# EAGLE design MySens-GWeasyRS485-Nano-V02-003 (EAGLE 7.3.0)
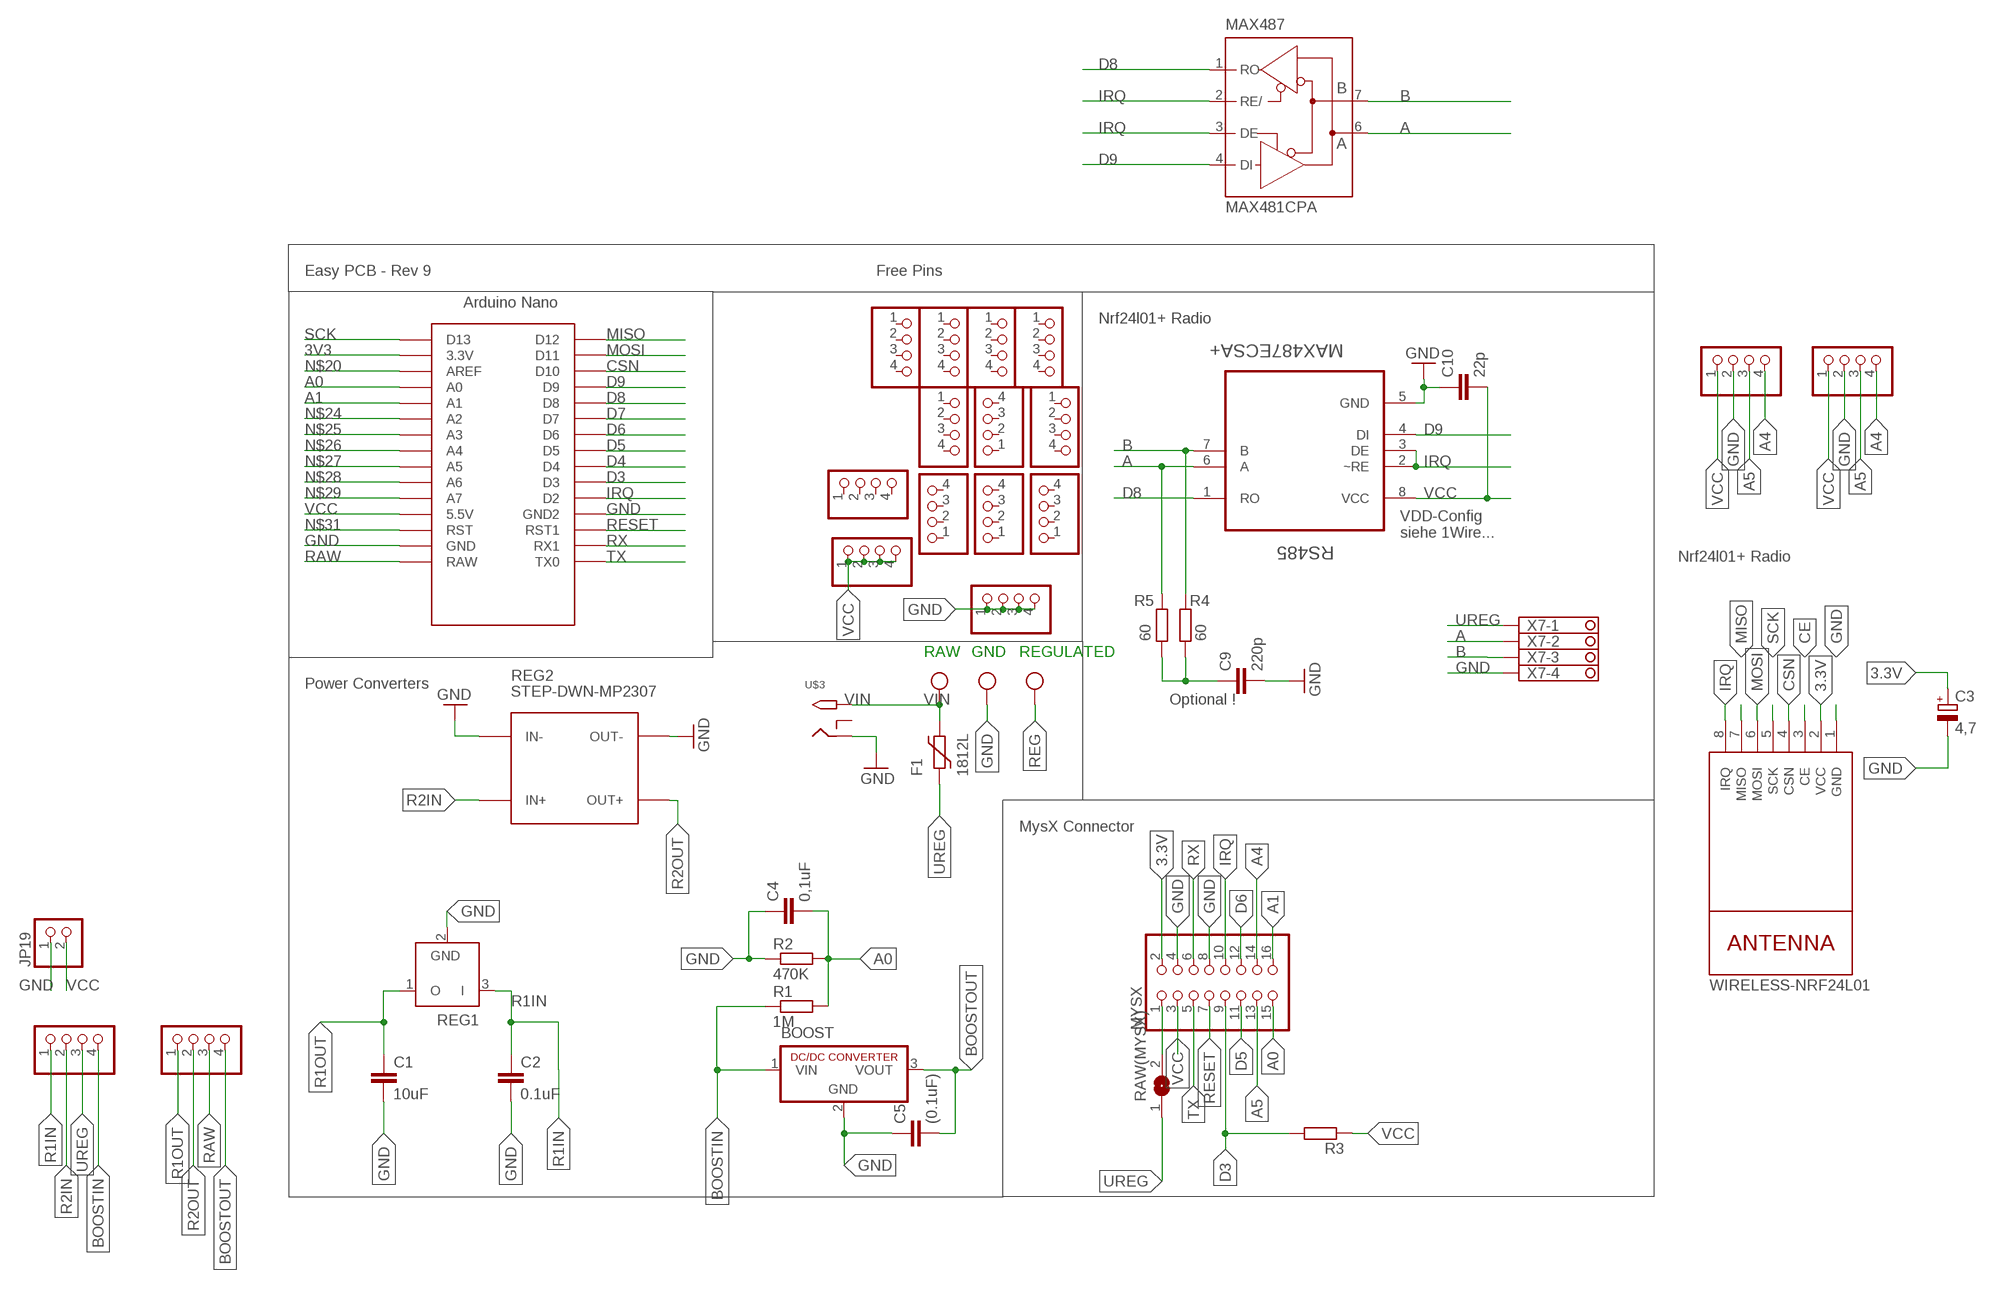
[diagram p0: schematic, sheet 1]

## Parts
BOOST  R-78C1.8-1.0  [SIP3]
C1  10uF  C-EUC1210  [C1210]
C2  0.1uF  C-EUC1206  [C1206]
C3  4,7  CPOL-EUSMCC  [SMC_C]
C4  0,1uF  C-EUC1206  [C1206]
C5  (0.1uF)  C-EUC1206  [C1206]
C9  220p  C-EUC0805  [C0805]
C10  22p  C-EUC0805  [C0805]
F1  1812L  [1812L]
JP1  PINHD-1X04_2.54-S  [1X04-S]
JP2  PINHD-1X04_2.54-S  [1X04-S]
JP3  PINHD-1X04_2.54-S  [1X04-S]
JP4  PINHD-1X04_2.54-S  [1X04-S]
JP5  PINHD-1X04_2.54-S  [1X04-S]
JP6  PINHD-1X04_2.54-S  [1X04-S]
JP7  PINHD-1X04_2.54-S  [1X04-S]
JP9  PINHD-1X04_2.54-S  [1X04-S]
JP10  PINHD-1X04_2.54-S  [1X04-S]
JP11  PINHD-1X04_2.54-S  [1X04-S]
JP12  PINHD-1X04_2.54-S  [1X04-S]
JP13  PINHD-1X04_2.54-S  [1X04-S]
JP14  PINHD-1X04_2.54-S  [1X04-S]
JP15  PINHD-1X04_2.54-S  [1X04-S]
JP16  PINHD-1X04_2.54-S  [1X04-S]
JP17  PINHD-1X04_2.54-S  [1X04-S]
JP18  PINHD-1X04_2.54-S  [1X04-S]
JP19  PINHD-1X2  [1X02]
MAX487  MAX481CPA  [DIL08]
MYSX  PINHD-2X08_2.54  [2X08]
NRF24L01+  WIRELESS-NRF24L01  [WIRELESS-NRF24L01]
R1  1M  R-EU_R0805  [R0805]
R2  470K  R-EU_R0805  [R0805]
R3  R-EU_R0805  [R0805]
R4  60  R-EU_R0805  [R0805]
R5  60  R-EU_R0805  [R0805]
RAW(MYSX)  SJ  [SJ]
REG1  LP2950Z  [TO92]
REG2  STEP-DWN-MP2307  DC-DC-STEP-DOWN-MP2307  [DC-DC-STEP-DOWN-MP2307]
REGULATED  W237-103  [W237-103]
RS485  MAX487ECSA+  [SOIC127P600X175-8N]
U$2  NANO  [NANO]
U$3  2.1MMJACKTHM  [PJ-102A]
X7  1751264  [1751264]

## Nets
3.3V [Power]: C3.+ MYSX.2 NRF24L01+.2(VCC)
3V3: U$2.3.3V
A: MAX487.6(A) R5.2 RS485.6(A) X7.2
A0: C4.2 MYSX.15 R1.2 R2.2 U$2.A0
A1: MYSX.16 U$2.A1
A4: JP6.4 JP10.4 MYSX.14
A5: JP6.3 JP10.3 MYSX.13
B: MAX487.7(B) R4.2 RS485.7(B) X7.3
BOOSTIN [Power]: BOOST.1(VIN) JP2.4 R1.1
BOOSTOUT [Power]: BOOST.3(VOUT) C5.2 JP4.4
CE: NRF24L01+.3(CE)
CSN: NRF24L01+.4(CSN) U$2.D10
D3: MYSX.9 R3.2 U$2.D3
D4: U$2.D4
D5: MYSX.11 U$2.D5
D6: MYSX.12 U$2.D6
D7: U$2.D7
D8: MAX487.1(RO) RS485.1(RO) U$2.D8
D9: MAX487.4(DI) RS485.4(DI) U$2.D9
GND [Power]: BOOST.2(GND) C1.2 C2.2 C3.- C4.1 C5.1 C9.2 C10.1 JP1.1 JP1.2 JP1.3 JP1.4 JP6.2 JP10.2 JP19.1 MYSX.4 MYSX.8 NRF24L01+.1(GND) R2.1 REG1.2(GND) REG2.IN- REG2.OUT- REGULATED.2 RS485.5(GND) U$2.GND U$2.GND1(GND2) U$3.RING X7.4
IRQ: MAX487.2(RE/) MAX487.3(DE) MYSX.10 NRF24L01+.8(IRQ) RS485.2(~RE) RS485.3(DE) U$2.D2
MISO: NRF24L01+.7(MISO) U$2.D12
MOSI: NRF24L01+.6(MOSI) U$2.D11
N$1: MYSX.1 RAW(MYSX).2
N$20: U$2.AREF
N$21: C9.1 R4.1 R5.1
N$24: U$2.A2
N$25: U$2.A3
N$26: U$2.A4
N$27: U$2.A5
N$28: U$2.A6
N$29: U$2.A7
N$31: U$2.RST
R1IN [Power]: C2.1 JP2.1 REG1.3(I)
R1OUT [Power]: C1.1 JP4.1 REG1.1(O)
R2IN [Power]: JP2.2 REG2.IN+
R2OUT [Power]: JP4.2 REG2.OUT+
RAW [Power]: JP4.3 U$2.RAW
REG [Power]: REGULATED.1
RESET: MYSX.7 U$2.RST1
RX: MYSX.6 U$2.RX1
SCK: NRF24L01+.5(SCK) U$2.D13
TX: MYSX.5 U$2.TX0
UREG [Power]: F1.P$1 JP2.3 RAW(MYSX).1 X7.1
VCC [Power]: C10.2 JP3.1 JP3.2 JP3.3 JP3.4 JP6.1 JP10.1 JP19.2 MYSX.3 R3.1 RS485.8(VCC) U$2.5V(5.5V)
VIN [Power]: F1.P$2 REGULATED.3 U$3.TIP
Unconnected: JP5.1 JP5.2 JP5.3 JP5.4 JP7.1 JP7.2 JP7.3 JP7.4 JP9.1 JP9.2 JP9.3 JP9.4 JP11.1 JP11.2 JP11.3 JP11.4 JP12.1 JP12.2 JP12.3 JP12.4 JP13.1 JP13.2 JP13.3 JP13.4 JP14.1 JP14.2 JP14.3 JP14.4 JP15.1 JP15.2 JP15.3 JP15.4 JP16.1 JP16.2 JP16.3 JP16.4 JP17.1 JP17.2 JP17.3 JP17.4 JP18.1 JP18.2 JP18.3 JP18.4 U$2.ICSP1 U$2.ICSP2 U$2.ICSP3 U$2.ICSP4 U$2.ICSP5 U$2.ICSP6 U$3.RING_SW

## Notes on the sheet
- Easy PCB - Rev 9 | Free Pins
- Nrf24l01+ Radio
- VDD-Config
  siehe 1Wire...
- Nrf24l01+ Radio
- RAW | GND | REGULATED
- Power Converters
- Optional !
- MysX Connector

## Power pins joined to a net without a drawn wire
GND: MAX487.5(GND)
VCC: MAX487.8(VCC)

## Library data of the parts
BOOST = dc-dc-converter:R-78C*-1.0: INNOLINE DC/DC-Converter 1.0 AMP SIP3 Single Output Source: Data sheet <http://www.mikrocontroller.net/attachment/150645/157764-da-01-en-DC_DC_WANDLER_R_78C5_0_1_0.pdf>
C1 C2 C4 C5 C9 C10 = rcl:C-EU: CAPACITOR, European symbol
C3 = rcl:CPOL-EU: POLARIZED CAPACITOR, European symbol
F1 = ptc-littlefuse:1812L
JP1-JP7 JP9-JP18 = pinhead-2:PINHD-1X04: PIN HEADER
JP19 = pinhead:PINHD-1X2: PIN HEADER
MAX487 = maxim-4:MAX481CPA: RS485 TRANSEIVER
MYSX = pinhead-2:PINHD-2X08: PIN HEADER
NRF24L01+ = diy-modules:WIRELESS-NRF24L01: 2.4 GHz Wireless Module based on NRF24L01 chip
R1-R5 = rcl:R-EU_: RESISTOR, European symbol
RAW(MYSX) = jumper:SJ: SMD solder JUMPER
REG1 = linear:LP2950: 100 mA, Low Power Low Dropout Voltage Regulator Source: http://www.onsemi.com/pub/Collateral/LP2950-D.PDF
REG2 = diy-modules:DC-DC-STEP-DOWN-MP2307: DC/DC Step-Down Regulator based on MP2307DN chip MP2307 datasheet available here: https://cdn-shop.adafruit.com/datasheets/MP2307_r1.9.pdf Click here to find device on ebay.com <http://www.ebay.com/sch/dc+dc+3a+mini+converter>
REGULATED = con-wago-500:W237-103: WAGO SCREW CLAMP; MPN: 237-103; OC_FARNELL: unknown; OC_NEWARK: 18M7116
RS485 = Maxim_By_element14_Batch_1:MAX487ECSA+: Low-Power, Slew-Rate-Limited RS-485/RS-422 Transceivers; MPN: MAX487ECSA+; OC_FARNELL: 9724532; OC_NEWARK: 68K4803; PACKAGE: SOIC-8; SUPPLIER: Maxim
U$2 = Arduino-clone:NANO: Arduino Nano
U$3 = adafruit:2.1MMJACK: 2.1mm x 5.5mm THM DC jack with internal switch. Digikey part #PJ-102A, 4UCON part #05537 2.1mm x 5.5mm SMT DC jack with internal switch. Digikey part #PJ-002A-SMT, 4UCON part #03267 By microbuilder.eu & adafruit.com
X7 = con-phoenix-350:1751264: MKDS 1/ 4-3,5 Printklemme Nennstrom: 10 A Bemessungsspannung: 160 V Raster: 3,5 mm Polzahl: 4 Montageart: Löten Anschlussart: Schraubanschluss Anschlussrichtung vom Leiter zur Platine: 0° Source: http://eshop.phoenixcontact.com .. 1751264.pdf; MPN: 1751264; OC_FARNELL: unknown; OC_NEWARK: 10R0934

## Net classes
0 default: width 0.305 mm
1 Power: width 0.508 mm

## Board
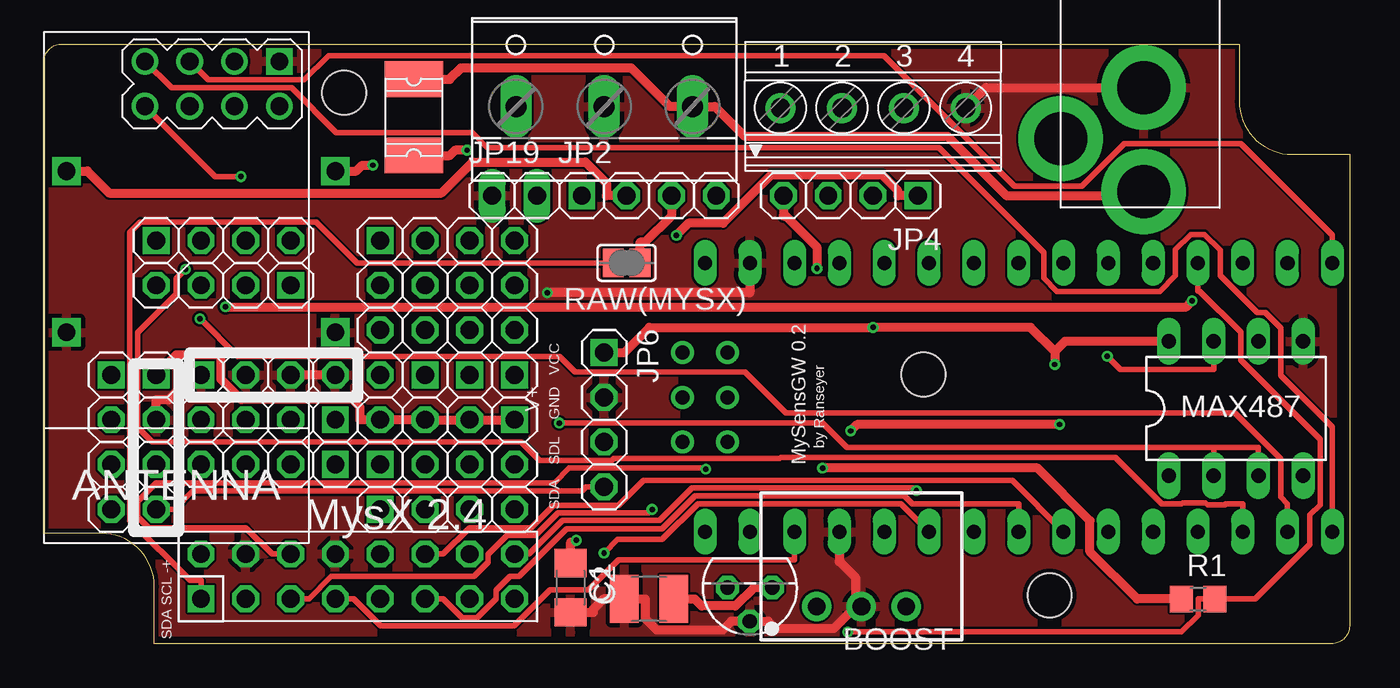
[diagram p1: board, top side]
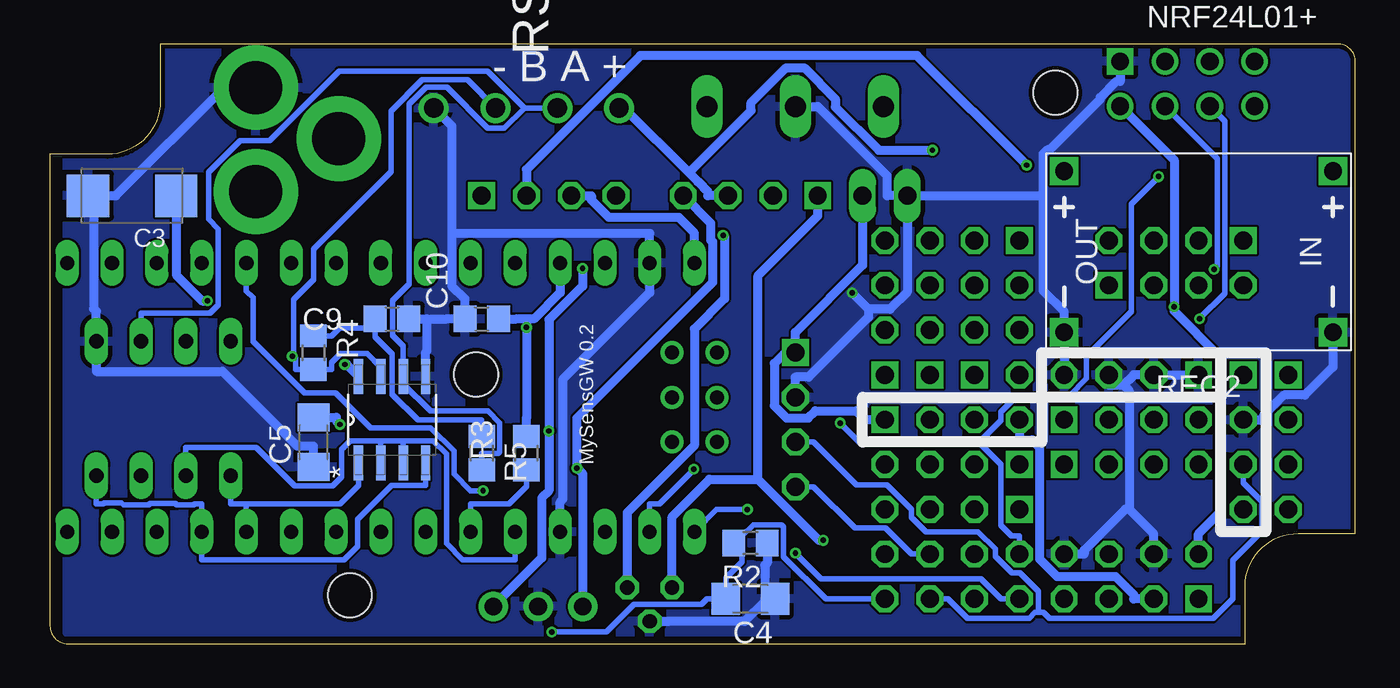
[diagram p2: board, bottom side, seen from below]

Size 74 x 34 mm. Coordinates in mm from the lower left corner, seen from the top.
Outline: 0,6.25 0,33 arc-90 1,34 67.75,34 67.75,30.75 arc90 70.75,27.75 74,27.75 74,1 arc-90 73,0 6.25,0 6.25,3.25 arc90 3.25,6.25 0,6.25
Copper layers (1*16): Top 0.035mm / dielectric 1.5mm / Bottom 0.035mm
Design rules "dirt_cheap_dirty_boards.v1": minimum track width 5mil, minimum drill 12mil, track to track 5mil, track to pad 5mil, pad to pad 5mil, via to via 5mil, smd to smd 0mil, copper to edge 10mil, drill to drill 10mil, minimum pad ring 10mil, minimum via ring 6mil, stop-mask expansion 2mil, vias tented up to drill 25mil, thermal gap 10mil
Holes 2.5 mm at 49.85,15.27 57,2.75 17,31.25

### Footprints (pad centres in the part's own frame; a part is rotated, then mirrored left to right if it is on the bottom)
SIP3 = drill 1 pad 1.676: 1 -2.54,0; 2 0,0; 3 2.54,0
C1210 = smd 1.6 x 2.7: 1 -1.4,0; 2 1.4,0
C1206 = smd 1.6 x 1.8: 1 -1.4,0; 2 1.4,0
SMC_C = smd 2.4 x 2.4: + -2.5,0; - 2.5,0
C0805 = smd 1.3 x 1.5: 1 -0.95,0; 2 0.95,0
1812L = smd 2.03 x 3.3: P$1 -2.16,0; P$2 2.16,0
1X04-S = drill 1.016 square: 1 -3.81,0 | drill 1.016 octagon: 2 -1.27,0; 3 1.27,0; 4 3.81,0
1X02 = drill 1.016 long: 1 -1.27,0; 2 1.27,0
DIL08 = drill 0.813 long: 1 -3.81,-3.81; 2 -1.27,-3.81; 3 1.27,-3.81; 4 3.81,-3.81; 5 3.81,3.81; 6 1.27,3.81; 7 -1.27,3.81; 8 -3.81,3.81
2X08 = drill 1.016 square: 1 -8.89,-1.27 | drill 1.016 octagon: 2 -8.89,1.27; 3 -6.35,-1.27; 4 -6.35,1.27; 5 -3.81,-1.27; 6 -3.81,1.27; 7 -1.27,-1.27; 8 -1.27,1.27; 9 1.27,-1.27; 10 1.27,1.27; 11 3.81,-1.27; 12 3.81,1.27; 13 6.35,-1.27; 14 6.35,1.27; 15 8.89,-1.27; 16 8.89,1.27
WIRELESS-NRF24L01 = drill 1 square: 1 -12.7,6.35 | drill 1: 2 -10.16,6.35; 3 -12.7,3.81; 4 -10.16,3.81; 5 -12.7,1.27; 6 -10.16,1.27; 7 -12.7,-1.27; 8 -10.16,-1.27
R0805 = smd 1.3 x 1.5: 1 -0.95,0; 2 0.95,0
SJ = smd 1.168 x 1.6: 1 -0.762,0; 2 0.762,0
TO92 = drill 0.813 octagon: 1 -1.27,0; 2 0,1.905; 3 1.27,0
DC-DC-STEP-DOWN-MP2307 = drill 1 pad 1.6 square: IN+ -7.62,-4.572; IN- -7.62,4.572; OUT+ 7.62,-4.572; OUT- 7.62,4.572
W237-103 = drill 1.194 long: 1 -5,-1.29; 2 0,-1.29; 3 5,-1.29
SOIC127P600X175-8N = smd 1.981 x 0.533: 1 -2.464,1.905; 2 -2.464,0.635; 3 -2.464,-0.635; 4 -2.464,-1.905; 5 2.464,-1.905; 6 2.464,-0.635; 7 2.464,0.635; 8 2.464,1.905
NANO = drill 0.8 long: 3.3V -10.16,24.13; 5V -10.16,-1.27; A0 -10.16,19.05; A1 -10.16,16.51; A2 -10.16,13.97; A3 -10.16,11.43; A4 -10.16,8.89; A5 -10.16,6.35; A6 -10.16,3.81; A7 -10.16,1.27; AREF -10.16,21.59; D2 5.08,1.27; D3 5.08,3.81; D4 5.08,6.35; D5 5.08,8.89; D6 5.08,11.43; D7 5.08,13.97; D8 5.08,16.51; D9 5.08,19.05; D10 5.08,21.59; D11 5.08,24.13; D12 5.08,26.67; D13 -10.16,26.67; GND -10.16,-6.35; GND1 5.08,-1.27; RAW -10.16,-8.89; RST -10.16,-3.81; RST1 5.08,-3.81; RX1 5.08,-6.35; TX0 5.08,-8.89 | drill 0.8: ICSP1 -5.08,-10.16; ICSP2 -5.08,-7.62; ICSP3 -2.54,-10.16; ICSP4 -2.54,-7.62; ICSP5 0,-10.16; ICSP6 0,-7.62
PJ-102A = drill 3 pad 4.8: RING 0.1,-3.39; RING_SW -4.6,-6.29; TIP 0.1,-9.29
1751264 = drill 1.1 pad 1.7: 1 -5.25,-0.1; 2 -1.75,-0.1; 3 1.75,-0.1; 4 5.25,-0.1

### Placement (x,y rotation side)
BOOST  46.33,2.11 0 top
C1  34.29,2.54 180 top
C2  29.84,3.17 270 top
C3  69.34,25.4 180 bottom
C4  34.29,2.54 180 bottom
C5  59.05,11.43 90 bottom
C9  54.61,18.41 0 bottom
C10  49.53,18.41 0 bottom
F1  20.95,29.84 90 top
JP1  12.7,15.24 0 top
JP2  34.29,25.4 0 top
JP3  22.86,12.7 180 top
JP4  45.72,25.4 180 top
JP5  12.7,10.16 180 top
JP6  31.75,12.7 270 top
JP7  24.13,19.05 90 top
JP9  10.16,22.86 0 top
JP10  6.35,11.43 270 top
JP11  10.16,20.32 180 top
JP12  12.7,12.7 180 top
JP13  26.67,19.05 90 top
JP14  19.05,19.05 270 top
JP15  22.86,10.16 0 top
JP16  3.81,11.43 270 top
JP17  21.59,19.05 90 top
JP18  22.86,7.62 0 top
JP19  26.67,25.4 0 top
MAX487  67.56,13.34 0 top
MYSX  17.78,3.81 0 top
NRF24L01+  6.99,20.32 270 top
R1  65.41,2.54 0 top
R2  34.29,5.71 180 bottom
R3  46.99,10.79 270 bottom
R4  59.05,16.51 270 bottom
R5  49.53,10.79 270 bottom
RAW(MYSX)  33.02,21.59 180 top
REG1  40.01,3.17 180 top
REG2  8.89,22.23 180 bottom
REGULATED  31.75,31.75 0 top
RS485  54.61,12.7 90 bottom
U$2  46.35,11.43 270 top
U$3  62.23,34.92 0 top
X7  46.99,30.48 0 top

### Tracks (layer width: path | path; a pad name or v marks a point on that pad's centre or on a via)
3.3V  (via drill 0.3 pad 0.61)
  Top 0.508: v10.28,19.1 64.74,19.1 v65.07,19.44
  Bottom 0.508: C3.+ 66.84,20.91 65.37,19.44 v65.07,19.44 | NRF24L01+.2 10.28,27.42 v10.28,19.1 10.28,18.87 7.7,16.3 7.7,7.41 8.89,6.22 MYSX.2
A
  Bottom 0.305: 47.1,30.38 49.19,32.46 57.61,32.46 61.54,28.54 63.23,28.54 65.01,26.75 65.01,24.07 64.47,23.52 64.47,19.2 64.92,18.75 68.83,18.75 MAX487.6 | 47.1,30.38 48.25,29.24 49.2,29.24 51.5,31.54 52.69,31.54 53.64,30.59 53.64,20.4 54.59,19.45 54.59,17.48 53.98,16.87 RS485.6 53.98,14.74 52.43,13.2 49.18,13.2 48.5,12.52 48.5,10.88 48.6,10.77 49.53,10.77 R5.2 | X7.2 47.1,30.38
A0  (via drill 0.3 pad 0.61)
  Top 0.305: U$2.A0 65.41,20 65.48,20 67.83,17.66 67.83,16.09 72.33,11.59 72.33,7.88 71.75,7.31 71.75,5.64 68.66,2.54 R1.2 65.42,2.54 65.42,1.61 64.48,0.66 v45.56,0.66
  Bottom 0.305: 34.77,5.71 34.77,6.1 34.13,6.75 32.54,6.75 32.41,6.62 32.41,4.93 30.02,2.54 MYSX.15 | 34.77,5.71 34.77,4.63 35.69,3.72 C4.2 36.77,2.54 37.08,2.23 40.89,2.23 42.46,0.66 v45.56,0.66 | R2.2 34.77,5.71
A1  (via drill 0.3 pad 0.61)
  Top 0.305: v49.45,8.67 49.3,8.82 36.73,8.82 34.89,6.98 29.4,6.98 27.5,5.08 MYSX.16
  Bottom 0.305: U$2.A1 62.87,20 62.48,19.62 62.48,17.13 59.57,14.21 57.81,14.21 55.84,12.24 52.41,12.24 51.1,10.92 51.1,9.62 50.15,8.67 v49.45,8.67
A4
  Top 0.305: JP6.4 30.71,8.89 30.48,8.66 8.43,8.66 7.39,7.62 JP10.4
  Bottom 0.305: JP6.4 30.71,8.89 28.37,6.55 26.64,6.55 25.17,5.08 MYSX.14
A5
  Bottom 0.305: 17.97,1.76 17.97,2.98 19.01,4.01 19.47,4.01 20.41,4.95 20.41,5.37 21.39,6.35 24.35,6.35 25.17,7.17 25.17,7.62 26.56,9.01 28.29,9.01 30.71,11.43 JP6.3 | 17.97,1.76 17.68,1.76 17.34,1.43 8.06,1.43 6.96,2.53 6.96,4.72 5.31,6.37 5.31,8.08 6.35,9.12 JP10.3 | 17.97,1.76 18.16,1.76 18.49,1.43 21.98,1.43 23.09,2.54 MYSX.13
B  (via drill 0.3 pad 0.61)
  Top 0.305: MAX487.7 66.29,15.54 61.02,15.54 v60.27,16.29
  Bottom 0.305: X7.3 50.34,31.98 52.9,31.98 54.66,30.21 54.66,26.76 59.05,22.37 59.05,20.64 60.18,19.52 60.18,16.29 | 60.18,16.29 60.08,16.2 60.08,15.56 R4.2 58.03,15.56 58.03,15.95 57.53,16.44 56.01,16.44 55.24,15.67 55.24,15.53 RS485.7 | 60.18,16.29 v60.27,16.29
BOOSTIN  (via drill 0.3 pad 0.61)
  Top 0.508: R1.1 61.97,2.54 59.29,5.22 59.29,6.97 56.31,9.95 v44.13,9.95
  Bottom 0.508: JP2.4 36.53,23.83 36.53,22.88 36.43,22.77 36.43,20.5 44.13,12.8 v44.13,9.95 43.79,9.62 BOOST.1
BOOSTOUT  (via drill 0.3 pad 0.61)
  Top 0.508: JP4.4 41.91,24.26 42.05,24.26 43.81,22.5 v43.81,21.27 | v57.57,12.43 46.09,12.43 v45.72,12.06
  Bottom 0.508: v43.81,21.27 43.81,20.28 45.72,18.37 v45.72,12.06 45.72,8.66 46.12,8.26 46.12,4.86 BOOST.3 | C5.2 57.77,12.83 57.77,12.64 v57.57,12.43
CSN  (via drill 0.3 pad 0.61)
  Top 0.305: U$2.D10 67.94,7.94 66.99,7.94 66.92,7.87 65.96,7.87 65.84,7.99 64.54,7.99 64.47,7.92 63.37,7.92 60.73,10.56 41.76,10.56 41.7,10.5 32.29,10.5 32.18,10.39 28.09,10.39 27.05,11.43 6.13,11.43 5.31,12.25 5.31,17.66 7.48,19.82 7.48,20.7 v8.01,21.23
  Bottom 0.305: NRF24L01+.4 7.83,27.51 7.83,21.41 v8.01,21.23
D3  (via drill 0.3 pad 0.61)
  Top 0.305: v31.74,5.13 32.52,5.9 35.03,5.9 37.07,7.94 48.58,7.94 U$2.D3
  Bottom 0.305: v31.74,5.13 30.3,3.69 21.24,3.69 | 21.24,3.69 | 21.24,3.69 20.09,2.54 MYSX.9 | R3.2 46.99,8.91 47.97,7.94 50.16,7.94 U$2.D3
D5
  Top 0.305: U$2.D5 55.24,7.94 49.21,7.94 48.78,8.37 36.89,8.37 35.02,6.5 29.62,6.5 26.93,3.81 26.42,3.81 25.63,3.02 25.63,2.55 24.55,1.48 23.7,1.48 22.63,2.54 MYSX.11
D6
  Top 0.305: U$2.D6 54.88,9.26 33.97,9.26 32.56,7.85 28.87,7.85 27.6,6.58 24.13,6.58 22.63,5.08 MYSX.12
D8
  Bottom 0.305: RS485.1 56.52,8.97 57.54,7.94 62.87,7.94 | MAX487.1 63.75,7.92 63.37,7.92 63.35,7.94 62.87,7.94 | U$2.D8 62.87,7.94
D9
  Bottom 0.305: RS485.4 52.7,8.97 54.64,8.97 56.57,7.04 56.57,5.53 57.33,4.76 65.41,4.76 U$2.D9 65.41,7.94 65.79,7.94 65.86,7.87 66.82,7.87 66.89,7.94 68.33,7.94 68.4,7.87 69.83,7.87 69.95,7.99 70.92,7.99 70.98,7.92 71.37,7.92 MAX487.4
GND  (via drill 0.3 pad 0.61)
  Top 0.508: v28.53,19.9 40.01,19.9 U$2.GND | JP1.4 JP1.3 | X7.4 53.4,31.54 U$3.RING | 46.01,2.11 46.01,3.73 45.09,4.66 U$2.GND1 | 46.01,2.11 44.76,0.86 41.46,0.86 41.05,1.27 REG1.2 38.96,1.27 38.48,0.78 34.72,0.78 34.07,1.43 34.07,2.54 C4.1 31.71,2.54 31.13,1.96 31.13,1.77 C2.2 | BOOST.2 46.01,2.11 | JP1.1 7.75,15.24 7.75,14.53 7.06,13.84 6.35,13.84 JP10.2
  Bottom 0.508: 51.23,23.28 51.23,20.29 50.48,19.55 C10.1 51.51,18.41 52.63,18.41 | X7.4 51.23,29.37 51.23,23.28 | 51.23,23.28 40.01,23.28 U$2.GND 40.01,19.9 44.94,14.97 44.94,8.19 | 44.94,8.19 | 44.94,8.19 45.09,8.04 U$2.GND1 | 27.6,18.97 v28.53,19.9 | JP19.1 25.4,19.95 26.38,18.97 27.6,18.97 | 27.6,18.97 27.6,18.51 30.99,15.11 31.75,15.11 JP6.2 | REGULATED.2 30.47,30.46 26.54,26.53 26.54,25.4 JP19.1 | JP19.1 25.18,25.4 24.26,25.4 17.7,25.4 | 12.83,7.62 11.43,6.22 MYSX.4 | 13.14,14.67 12.83,14.35 12.83,7.62 | 12.83,7.62 13.05,7.62 15.37,5.3 15.37,5.08 MYSX.8 | 13.14,14.67 12.57,15.24 JP1.2 JP1.1 | 13.14,14.67 13.97,14.67 JP1.3 | REG1.2 38.96,1.27 38.95,1.26 34.62,1.26 33.48,2.4 33.48,2.54 | 33.48,2.54 33.48,4.44 33.34,4.58 R2.1 | C4.1 33.48,2.54 | 17.7,25.4 17.7,20.03 16.51,18.83 REG2.OUT- JP1.4 | 17.7,25.4 17.7,27.76 17.46,28.01 17.33,28.01 14.47,30.87 14.47,30.96 13.55,31.89 13.34,31.89 NRF24L01+.1 | 71.52,25.4 71.52,19 71.37,18.85 MAX487.5 71.37,15.44 64.22,15.44 59.98,11.21 59.05,11.21 C5.1 | 71.52,25.4 70.26,25.4 64.13,31.54 U$3.RING | C3.- 71.52,25.4 | 52.63,18.41 52.63,16.61 52.7,16.54 RS485.5 | C9.2 52.63,18.41 | JP10.2 5.21,12.7 5.21,12.94 4.05,14.1 2.86,14.1 1.27,15.69 REG2.IN-
  pour Top: 0,0.64 0,34.29 73.03,34.29 73.03,0.64
  pour Bottom: 0,34.29 0,0.64 73.03,0.64 73.03,34.29
IRQ  (via drill 0.3 pad 0.61)
  Top 0.305: v11.15,26.49 9.71,26.49 NRF24L01+.8 | v29.21,12.51 44.12,12.51 45.5,11.12 66.29,11.12 | MAX487.3 68.83,11.12 66.29,11.12 | MAX487.2 66.29,11.12
  Bottom 0.305: 53.98,11.51 52.29,11.51 51.53,10.74 51.53,5.67 50.62,4.76 47.62,4.76 U$2.D2 | 21.34,11.42 28.11,11.42 v29.21,12.51 | 21.34,11.42 20.09,10.17 20.09,6.71 19.51,6.12 19.05,6.12 MYSX.10 | 21.34,11.42 20.09,12.67 20.09,13.14 19.18,14.05 16.22,14.05 15.24,15.03 15.24,16.28 12.7,18.82 12.7,24.94 v11.15,26.49 | RS485.3 53.98,11.51 | 55.24,11.51 53.98,11.51 | 55.24,11.51 56.98,11.51 57.47,11.02 57.47,9.47 57.98,8.95 60.13,8.95 62.31,11.12 66.29,11.12 MAX487.2 | RS485.2 55.24,11.51
MISO
  Top 0.305: U$2.D12 73.03,12.29 70.1,15.21 70.1,17.91 69.23,18.78 68.78,18.78 66.67,20.88 66.67,22.31 65.78,23.2 65,23.2 64.14,22.34 64.14,20.88 63.23,19.98 57.41,19.98 56.67,20.72 56.67,22.19 50.72,28.14 25.12,28.14 24.28,28.98 16.56,28.98 14.02,31.51 7.22,31.51 NRF24L01+.7
MOSI  (via drill 0.3 pad 0.61)
  Top 0.305: v8.84,18.42 10.98,16.28 29.21,16.28 30.1,15.39 39.74,15.39 42.04,13.09 67.48,13.09 70.1,10.47 70.1,8.32 70.48,7.94 U$2.D11
  Bottom 0.305: NRF24L01+.6 7.4,29.62 7.4,19.87 v8.84,18.42
N$1
  Top 0.305: RAW(MYSX).2 17.75,21.59 15.43,23.91 5.46,23.91 4.86,23.32 4.86,7 8.28,3.58 8.89,3.58 MYSX.1
N$21
  Bottom 0.305: R4.1 58.03,17.46 57.59,17.9 55.56,17.9 | 55.56,17.9 55.56,17.39 54.6,16.43 54.6,14.14 53.14,12.68 49.53,12.68 R5.1 | C9.1 55.56,17.9
R1IN  (via drill 0.3 pad 0.61)
  Top 0.508: v30.17,5.86 30.06,5.76 29.84,5.76 C2.1
  Bottom 0.508: 33.86,9.32 30.41,5.86 v30.17,5.86 | REG1.3 38.73,7.2 36.62,9.32 33.86,9.32 | 33.86,9.32 33.86,20.88 30.48,24.26 JP2.1
R1OUT  (via drill 0.3 pad 0.61)
  Top 0.508: JP4.1 48.39,25.4 48.39,25.69 47.51,26.56 41.22,26.56 38.5,23.84 36.53,23.84 v35.84,23.16 | C1.1 36.87,2.54 37.28,2.13 39.19,2.13 40.23,3.17 REG1.1
  Bottom 0.508: v35.84,23.16 35.76,23.07 35.76,19.56 37.47,17.85 37.47,11.24 41.27,7.43 REG1.1
R2IN
  Top 0.508: JP2.2 31.88,25.4 31.88,26.12 30.69,27.31 24.28,27.31 22.52,25.56 3.69,25.56 2.45,26.8 REG2.IN+
R2OUT  (via drill 0.3 pad 0.61)
  Top 0.508: REG2.OUT+ 17.69,26.8 18.03,27.14 v18.63,27.14
  Bottom 0.508: v18.63,27.14 24.85,33.35 40.53,33.35 46.99,26.89 JP4.2
RAW
  Bottom 0.508: JP4.3 43.31,25.4 43.31,25.16 42.33,24.18 38.37,24.18 37.47,23.28 U$2.RAW
RESET
  Top 0.305: MYSX.7 17.55,2.54 19.07,1.02 26.64,1.02 28.68,3.06 30.86,3.06 32.55,4.76 42.55,4.76 U$2.RST1
RX  (via drill 0.3 pad 0.61)
  Top 0.305: v37.5,9.89 37.44,9.96 29.77,9.96 28.93,9.12 6.34,9.12 5.3,8.07 5.3,7.19 5.92,6.57 11.44,6.57 12.93,5.08 MYSX.6
  Bottom 0.305: U$2.RX1 40.01,7.94 39.46,7.94 v37.5,9.89
SCK
  Top 0.305: U$2.D13 73.03,23.18 67.84,28.36 61.23,28.36 58.82,25.95 54.99,25.95 47.59,33.35 16.12,33.35 14.75,31.98 9.3,31.98 NRF24L01+.5
TX  (via drill 0.3 pad 0.61)
  Top 0.305: v34.47,7.61 34.28,7.42 29.12,7.42 27.85,6.15 26.25,6.15 25.17,5.07 25.17,4.6 24.38,3.81 16.28,3.81 15.01,2.54 MYSX.5
  Bottom 0.305: U$2.TX0 36.21,7.61 v34.47,7.61
UREG  (via drill 0.3 pad 0.61)
  Top 0.508: F1.P$1 22.99,27.68 23.29,27.98 v23.98,27.98 | JP2.3 35.56,24.26 34.07,22.77 33.78,22.77 RAW(MYSX).1
  Bottom 0.508: 37.77,26.71 37.28,26.21 37.28,26.2 36.7,25.62 36.7,25.4 JP2.3 | X7.1 41.45,30.38 37.77,26.71 | 37.77,26.71 34.25,30.23 34.25,30.68 32.28,32.66 31.24,32.66 29.48,30.89 29.48,30.44 27.02,27.98 v23.98,27.98
VCC  (via drill 0.3 pad 0.61)
  Top 0.508: JP6.1 32.89,16.51 34.31,17.93 v46.99,17.93 55.92,17.93 57.29,16.56 | JP10.1 7.49,16.38 9.86,16.38 10.03,16.21 10.03,14.99 11.18,13.84 17.48,13.84 17.91,13.41 17.91,12.7 JP3.4 JP3.3 JP3.2 JP3.1 | 57.29,16.56 v57.29,15.83 | MAX487.8 57.88,17.14 57.29,16.56
  Bottom 0.508: 46.99,18.41 v46.99,17.93 46.99,12.78 R3.1 | 46.99,18.41 46.57,18.41 45.09,19.9 U$2.5V | 46.99,18.41 47.55,18.41 C10.2 | JP3.1 27.81,12.7 28.31,13.2 30.61,13.2 31.02,12.79 32.24,12.79 32.94,13.48 32.94,15.9 31.75,17.08 | 31.75,17.08 31.75,17.65 27.94,21.46 JP19.2 | JP6.1 31.75,17.08 | MYSX.3 12.57,2.54 12.57,2.78 13.61,3.81 16.92,3.81 17.91,4.8 17.91,11.13 18.34,11.56 19.05,11.56 JP3.4 | RS485.8 57.18,15.83 v57.29,15.83
VIN
  Top 0.508: U$3.TIP 62.09,25.39 54.58,25.39 51.22,28.75 39.73,28.75 38.03,30.46 REGULATED.3 35.47,30.46 33.29,32.64 23.62,32.64 22.99,32.01 F1.P$2

### Text on the board
tPlace: by Ranseyer | MysX 2.4
tNames: VCC GND RAW | V+ | VCC | GND | SDL | MySensGW 0.2 | SDA | SDA SCL -+
bNames: - B A + | MySensGW 0.2